# Altium schematic sheet GSM_GPS.SchDoc
size A4
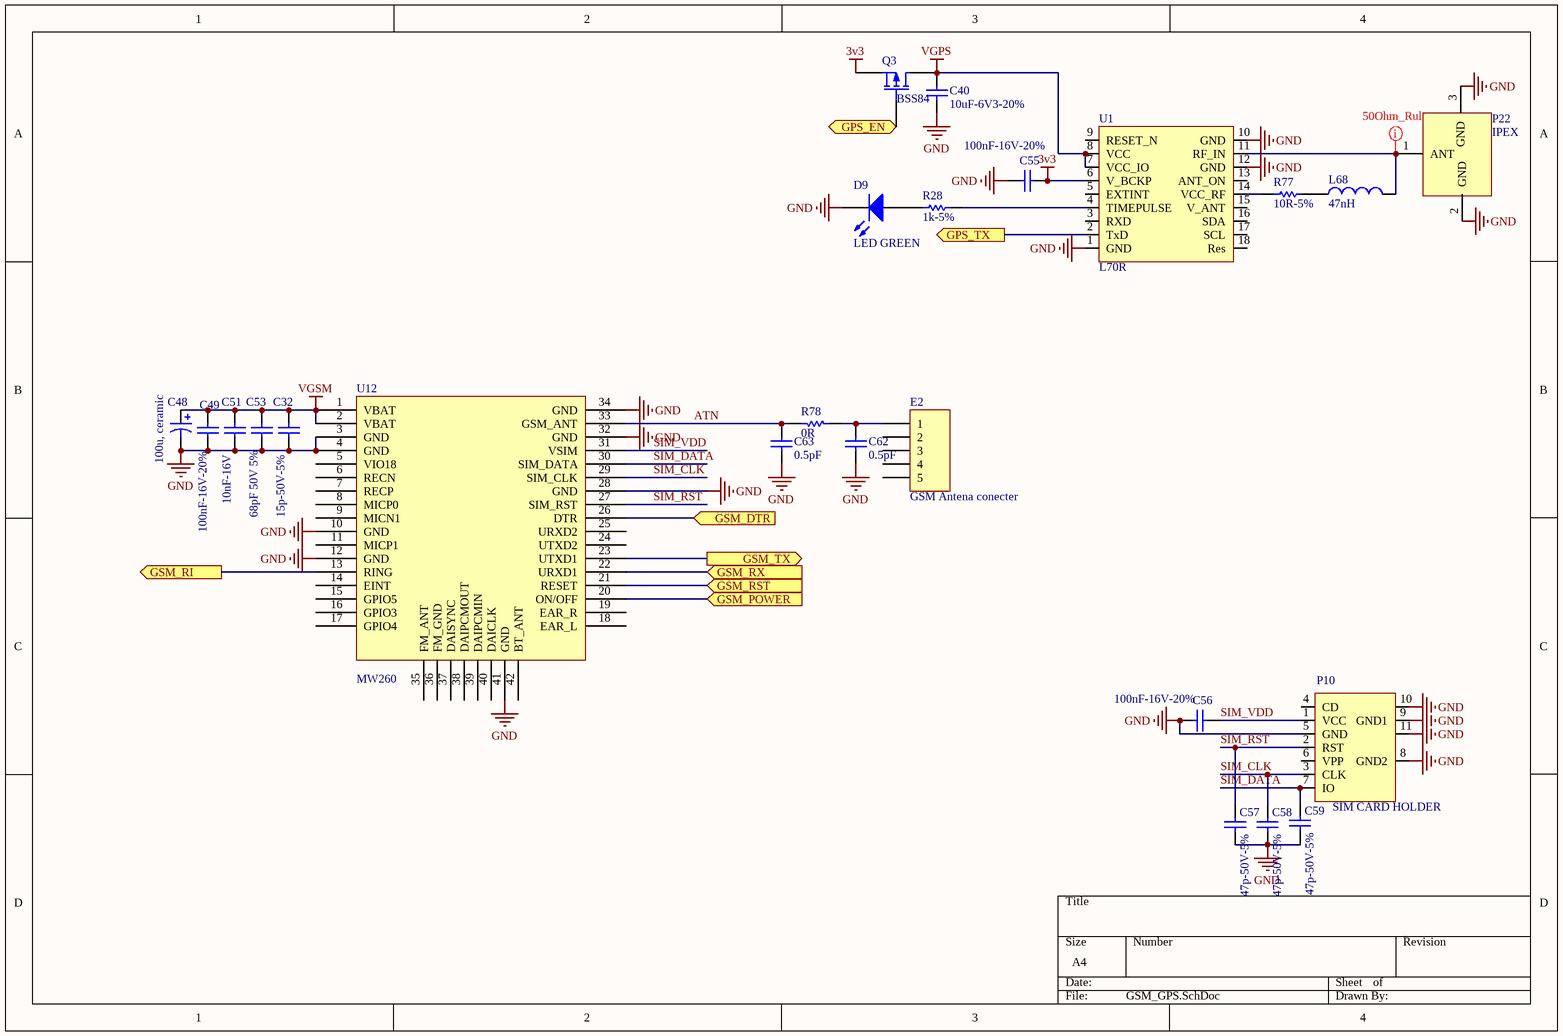
[diagram p0: GSM_GPS.SchDoc]

## Parts
C32  15p-50V-5%  [C0402]
C40  10uF-6V3-20%  [C0603]
C48  100u, ceramic  [C1812]
C49  100nF-16V-20%  [C0402]
C51  10nF-16V  [C0402]
C53  68pF 50V 5%  [C0402]
C55  100nF-16V-20%  [C0402]
C56  100nF-16V-20%  [C0402]
C57  47p-50V-5%  [C0402]
C58  47p-50V-5%  [C0402]
C59  47p-50V-5%  [C0402]
C62  0.5pF  [C0402]
C63  0.5pF  [C0402]
D9  LED GREEN  [LED0603-G]
E2  GSM Antena conecter  [A10343-GSM850/900/1800/1900/WCDMA]
L68  47nH  [C0603]
P10  SIM CARD HOLDER  [SIM MF01-412-063X]
P22  IPEX  [IPEX]
Q3  BSS84  [SOT23-3]
R28  1k-5%  [R0402]
R77  10R-5%  [R0402]
R78  0R  [R0402]
U1  L70R  [MAX7]
U12  MW260  [MW260-MODIFY]

## Ports
GPS_EN (in), GPS_TX (out), GSM_DTR (in), GSM_POWER (in), GSM_RI (out), GSM_RST (in), GSM_RX (in), GSM_TX (out)

## Nets
3v3: C55.1 Q3.2(S) U1.6(V_BCKP)
GND: C32.2 C40.1 C48.2 C49.2 C51.1 C53.2 C55.2 C56.2 C57.1 C58.1 C59.1 C62.1 C63.1 D9.2(K) P10.5(GND) P10.8(GND2) P10.9(GND1) P10.10(GND3) P10.11(GND4) P22.2(GND) P22.3(GND) U1.1(GND) U1.10(GND) U1.12(GND) U12.3(GND) U12.4(GND) U12.10(GND) U12.12(GND) U12.28(GND) U12.32(GND) U12.34(GND) U12.41(GND)
VGPS: C40.2 Q3.3(D) U1.7(VCC_IO) U1.8(VCC)
VGSM: C32.1 C48.1 C49.1 C51.2 C53.1 U12.1(VBAT) U12.2(VBAT)
ATN: C63.2 R78.1 U12.33(GSM_ANT)
GPS_EN: Q3.1(G) ; port GPS_EN
GPS_TX: U1.2(TxD) ; port GPS_TX
GSM_DTR: U12.26(DTR) ; port GSM_DTR
GSM_POWER: U12.20(ON/OFF) ; port GSM_POWER
GSM_RI: U12.13(RING) ; port GSM_RI
GSM_RST: U12.21(RESET) ; port GSM_RST
GSM_RX: U12.22(URXD1) ; port GSM_RX
GSM_TX: U12.23(UTXD1) ; port GSM_TX
SIM_CLK: C58.2 P10.3(CLK) U12.29(SIM_CLK)
SIM_DATA: C59.2 P10.7(IO) U12.30(SIM_DATA)
SIM_RST: C57.2 P10.2(RST) U12.27(SIM_RST)
SIM_VDD: C56.1 P10.1(VCC) U12.31(VSIM)
NetC62_2: C62.2 E2.1 R78.2
NetD9_1: D9.1(A) R28.2
NetL68_1: L68.1 R77.1
NetL68_2: L68.2 P22.1(ANT) U1.11(RF_IN)
NetR28_1: R28.1 U1.4(TIMEPULSE)
NetR77_2: R77.2 U1.14(VCC_RF)

Not connected (* = marked no-connect by the designer): E2 2 3 4 5; P10 4(CD) 6(VPP); U1 3(RXD) 5(EXTINT) 9(RESET_N) 13(ANT_ON) 15(V_ANT) 16(SDA) 17(SCL) 18(Res); U12 5(VIO18) 6(RECN) 7(RECP) 8(MICP0) 9(MICN1) 11(MICP1) 14(EINT) 15(GPIO5) 16(GPIO3) 17(GPIO4) 18(EAR_L) 19(EAR_R) 24(UTXD2) 25(URXD2) 35(FM_ANT) 36(FM_GND) 37(DAISYNC) 38(DAIPCMOUT) 39(DAIPCMIN) 40(DAICLK) 42(BT_ANT)

## Layout directives
rule Width Constraint [Pref Width = 26mil    Min Width = 26mil    Max Width = 26mil]; rule Clearance Constraint [Clearance = 10mil]: NetL68_2

## Library data of the parts
C32 = Cap: CAP CER 15PF 50V 5% NPO 0402; Manufacturer: Yageo; Manufacturer Part Number: CC0402JRNPO9BN150; Published: 8-Jun-2000; LatestRevisionDate: 17-Jul-2002; LatestRevisionNote: Re-released for DXP Platform.; PackageReference: C0402; Publisher: Altium Limited; Value: 15p-50V-5%; Digi-Key Part Number: 311-1017-1-ND; Unit Price: 0.00270
C40 = Cap: CAP CER 10UF 6.3V 20% X5R 0603; Manufacturer: Murata Electronics North America; Manufacturer Part Number: GRM188R60J106ME47D; Published: 8-Jun-2000; LatestRevisionDate: 17-Jul-2002; LatestRevisionNote: Re-released for DXP Platform.; PackageReference: C0603; Publisher: Altium Limited; Value: 10uF-6V3-20%; Digi-Key Part Number: 490-3896-1-ND; Unit Price: 0.07873
C48 = Cap Pol3: CAP CER 100UF 10V 20% X5R 1812; Manufacturer Part Number: C4532X5R1A107M; Manufacturer: TDK Corporation; Published: 8-Jun-2000; LatestRevisionDate: 29-May-2009; LatestRevisionNote: IPC-7351 Footprint Added.; PackageReference: C0805; Publisher: Altium Limited; PackageDescription: Chip Capacitor; Digi-Key Part Number: 445-7743-2-ND; Unit Price: 0.55800
C49 C55 C56 = Cap: CAP CER 0.1UF 16V Y5V 0402; Manufacturer: Yageo; Manufacturer Part Number: CC0402ZRY5V7BB104; Published: 8-Jun-2000; LatestRevisionDate: 17-Jul-2002; LatestRevisionNote: Re-released for DXP Platform.; PackageReference: C0402; Publisher: Altium Limited; Value: 100nF-16V-20%; Digi-Key Part Number: 311-1047-1-ND; Unit Price: 0.00250
C51 = 10nF-16V-C0402-10%: CAP CER 10000PF 16V 10% X7R 0402; Manufacturer: Yageo; Manufacturer Part Number: CC0402KRX7R7BB103; Digi-Key Part Number: 311-1042-2-ND; Unit Price: 0.00216
C53 = Cap: CAP CER 68PF 50V 5% NPO 0402; Manufacturer: Yageo; Manufacturer Part Number: CC0402JRNPO9BN680; Digi-Key Part Number: 311-1340-2-ND; Unit Price: 10,000=0.00227
C57-C59 = Cap: CAP CER 47PF 50V 5% NPO 0402; Manufacturer: Yageo; Manufacturer Part Number: CC0402JRNPO9BN470; Published: 8-Jun-2000; LatestRevisionDate: 17-Jul-2002; LatestRevisionNote: Re-released for DXP Platform.; PackageReference: C0603; Publisher: Altium Limited; Value: 47p-50V-5%; Digi-Key Part Number: 311-1021-1-ND; Unit Price: 0.00270
C62 C63 = 0.5pF-50V-C0805: Non-Polarized Capacitor; Manufacturer: Yageo; Manufacturer Part Number: CC0805CRNPO9BNR50; Value: 0.5pF; Digi-Key Part Number: 311-1094-1-ND; Unit Price: 0.1
D9 = LED2: LED GREEN CLEAR THIN 0603 SMD; Manufacturer: Lite-On Inc; Manufacturer Part Number: LTST-C191KGKT; Published: 8-Jun-2000; LatestRevisionDate: 17-Jul-2002; LatestRevisionNote: Re-released for DXP Platform.; PackageVersion: Feb-2002; PackageReference: 3.2X1.6X1.1; Publisher: Altium Limited; Digi-Key Part Number: 160-1446-2-ND; Unit Price: 0.03780; Value: LED GREEN
E2 = Header 5: Header, 5-Pin; LatestRevisionDate: 17-Jul-2002; LatestRevisionNote: Re-released for DXP Platform.; Publisher: Altium Limited
L68 = Inductor: Code_IEC: 1005; Published: 8-Jun-2000; LatestRevisionDate: 29-May-2009; LatestRevisionNote: IPC-7351 Footprint Added.; PackageReference: 0402-A; Publisher: Altium Limited; PackageDescription: Chip Inductor; Code_JEITA: 0402; Value: 47nH
P10 = SIM CARD: SIM _CONNECTOR_410108105011-2LF; Manufacturer: Tyrone
Q3 = MOSFET-P: MOSFET P-CH 50V 130MA SOT23-3; Manufacturer: Diodes Inc; Manufacturer Part Number: BSS84-7-F; Published: 8-Jun-2000; LatestRevisionDate: 17-Jul-2002; LatestRevisionNote: Re-released for DXP Platform.; PackageVersion: 1995/1996; PackageReference: E3; Publisher: Altium Limited; Digi-Key Part Number: BSS84-FDITR-ND; Unit Price: 0.06000
R28 = Res1: RES 1.0K OHM 1/16W 5% 0402 SMD; Manufacturer: Yageo; Manufacturer Part Number: RC0402JR-071KL; Published: 8-Jun-2000; LatestRevisionDate: 17-Jul-2002; LatestRevisionNote: Re-released for DXP Platform.; PackageReference: R0603; Publisher: Altium Limited; Value: 1k-5%; Digi-Key Part Number: 311-1.0KJRCT-ND; Unit Price: 0.00178
R77 = 10R-5%-R0402: RES 10 OHM 1/16W 5% 0402 SMD; Manufacturer: Yageo; Manufacturer Part Number: RC0402JR-0710RL; Digi-Key Part Number: 311-10JRTR-ND; Unit Price: 0.00130
R78 = 0R-0805
U1 = MAX-7
U12 = GSM_MW260: THINK WILL GSM MODULE; Price: 5.0